# Altium schematic sheet Comparator_HighSpeed.SchDoc
size A4
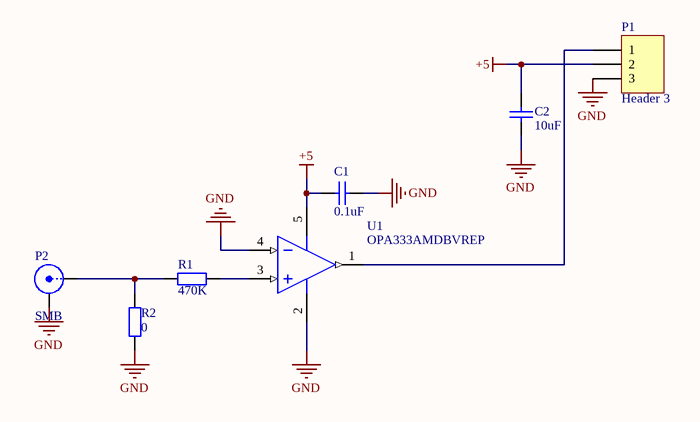
[diagram p0: Comparator_HighSpeed.SchDoc]

## Parts
C1  value 0.1uF  [C0805]  (hidden comment: Cap Semi)
C2  value 10uF  [C0805]  (hidden comment: Cap Semi)
P1  Header 3  [HDR1X3]
P2  SMB  [SMB_V-RJ45]
R1  value 470K  [C0805]  (hidden comment: Res2)
R2  value 0  [C0805]  (hidden comment: Res2)
U1  OPA333AMDBVREP  [TI-DBV5_N]

## Nets
+5: C1.1 C2.2 P1.2 U1.5(V+)
GND: C1.2 C2.1 P1.3 P2.2(Y) R2.1 U1.2(V-) U1.4(IN-)
NetP1_1: P1.1 U1.1(OUT)
NetP2_1: P2.1(X) R1.1 R2.2
NetR1_2: R1.2 U1.3(IN+)

## Library data of the parts
C1 C2 = Cap Semi: Capacitor (Semiconductor SIM Model); Published: 8-Jun-2000; LatestRevisionDate: 29-May-2009; LatestRevisionNote: IPC-7351 Footprint Added.; PackageReference: C1206; Publisher: Altium Limited; PackageDescription: Chip Capacitor
P1 = Header 3: Header, 3-Pin; LatestRevisionDate: 17-Jul-2002; LatestRevisionNote: Re-released for DXP Platform.; Publisher: Altium Limited
P2 = SMB: SMB Straight Connector; LatestRevisionDate: 17-Jul-2002; LatestRevisionNote: Re-released for DXP Platform.; Publisher: Altium Limited
R1 R2 = Res2: Resistor; Published: 8-Jun-2000; LatestRevisionDate: 17-Jul-2002; LatestRevisionNote: Re-released for DXP Platform.; PackageReference: AXIAL-0.4; Publisher: Altium Limited; PackageDescription: Axial Device, Thru-Hole; 2 Leads; 0.4 in Pin Spacing
U1 = OPA333AMDBVREP: Enhanced Product, Micropower CMOS Operational Amplifier Zero-Drift Series, 1.8 to 5.5 V, -55 to 125 degC, 5-pin SOT23 (DBV5), Green (RoHS & no Sb/Br); Manufacturer: Texas Instruments; CMRR(Min)(dB): 102; GBW(Typ)(MHz): 0.35; Iq per channel(Max)(mA): 0.025; Slew Rate(Typ)(V/us): 0.16; Sub Family: General Purpose Amplifier; Total Supply Voltage(Max)(+5V is 5, +/-5V is 10): 5.5; Total Supply Voltage(Min)(+5V is 5, +/-5V is 10): 1.8; DatasheetVersion: SGLS383B; PackageVersion: 4073253-4/K, 03/2006; PackageReference: DBV5; PackageDescription: 5-Pin Plastic Small Outline, Body 1.6 x 2.9 mm, Pitch 0.95 mm; Supplier 1: Digi-Key; Supplier Part Number 1: 296-22187-2-ND; Supplier 2: Digi-Key; Supplier Part Number 2: 296-22187-1-ND; Supplier 3: Digi-Key; Supplier Part Number 3: 296-22187-6-ND; Supplier 4: Mouser; Supplier Part Number 4: 595-OPA333AMDBVREP; Eco-Plan: Green (RoHS & no Sb/Br); Mounting Technology: Surface Mount; Code_JEDEC: MO-178; PartNumber: OPA333AMDBVREP; ComponentLink1Description: Manufacturer URL; ComponentLink1URL: http://www.ti.com/; ComponentLink2Description: Datasheet; ComponentLink2URL: http://www.ti.com/lit/ds/symlink/opa333a-ep.pdf; ComponentLink3Description: Package Specification; ComponentLink3URL: http://www.ti.com/litv/pdf/mpds018i